# Altium project GateWay.PrjPcb (part 2 of 2)

## Sheet [03].PCIe.SchDoc
size A4; Organization: Altium Limited; Address1: L3, 12a Rodborough Rd; Address2: Frenchs Forest; Address3: NSW; Address4: Australia 2086
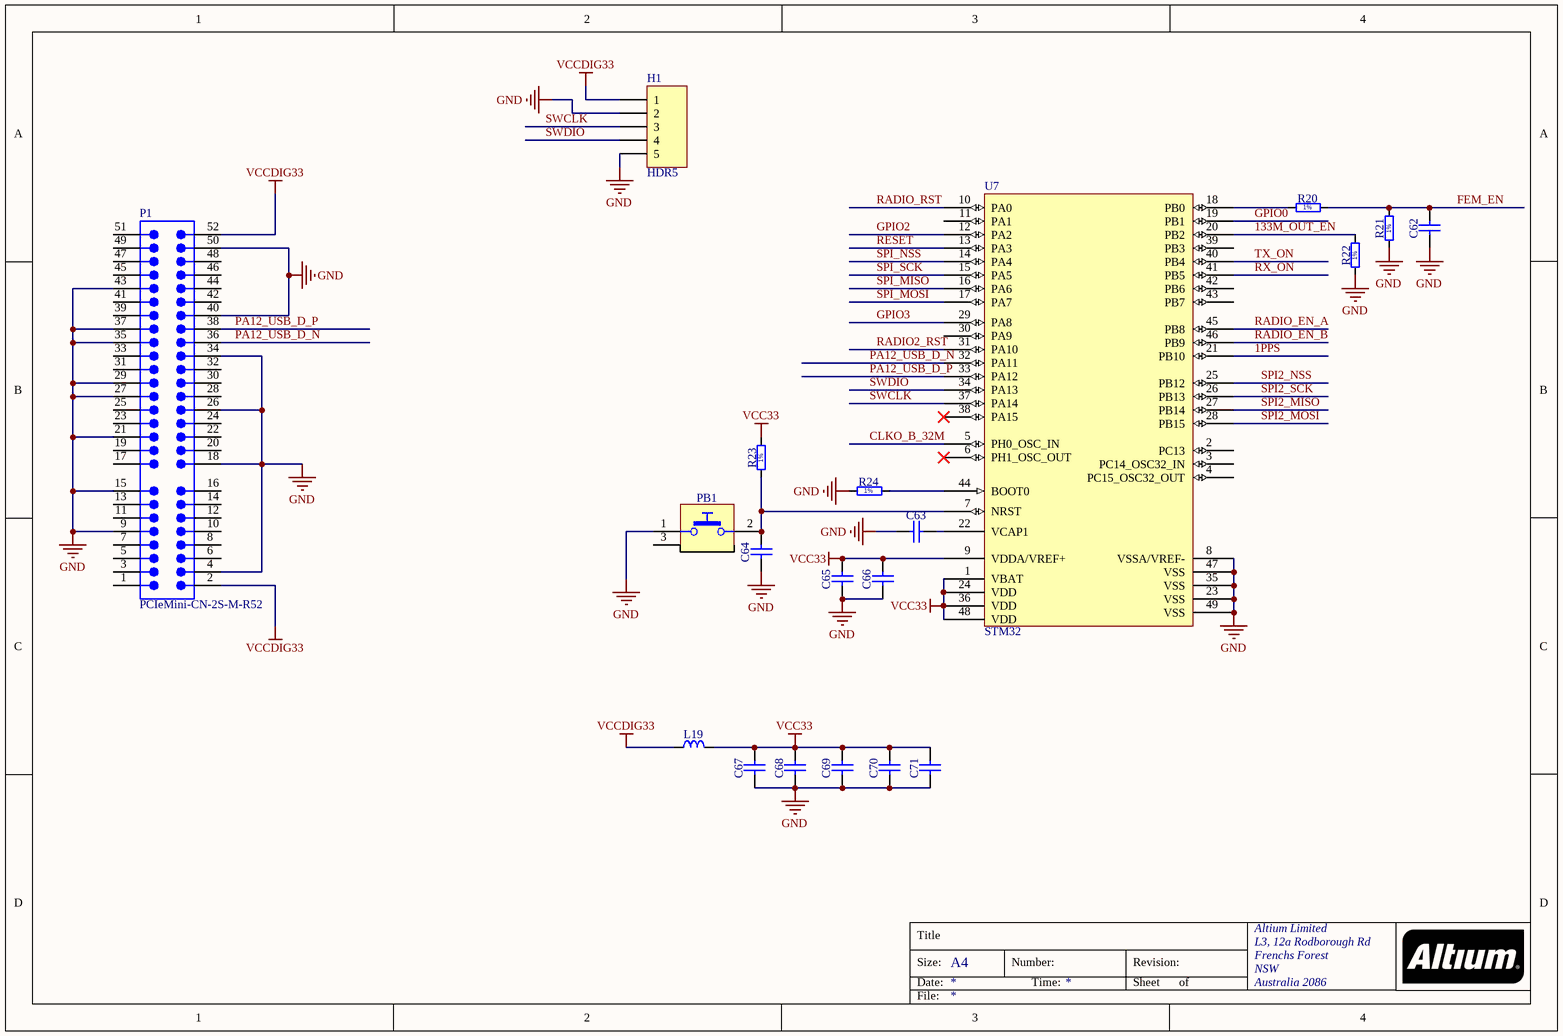
[diagram p4: [03].PCIe.SchDoc]

### Parts
C62  56pF  [CAPC1005X55N]  (value not drawn)
C63  4.7nF  [CAPC1005X55N]  (value not drawn)
C64  100nF  [CAPC1005X55N]  (value not drawn)
C65  100nF  [CAPC1005X55N]  (value not drawn)
C66  100nF  [CAPC1005X55N]  (value not drawn)
C67  4.7nF  [CAPC1005X55N]  (value not drawn)
C68  100nF  [CAPC1005X55N]  (value not drawn)
C69  100nF  [CAPC1005X55N]  (value not drawn)
C70  100nF  [CAPC1005X55N]  (value not drawn)
C71  100nF  [CAPC1005X55N]  (value not drawn)
H1  HDR5  [HDR5]
L19  600R@100MHz  [INDC1005X55N]  (value not drawn)
P1  PCIeMini-CN-2S-M-R52  [PCIeMini-GF-2D-800-1K-S52]  (no BOM)
PB1  Push Button  [PB_OMRON_B3U-1100P]  (value not drawn)
R20  100  [RESC1005X40N]  (value not drawn)
R21  0  [RESC1005X40N]  (value not drawn)
R22  10k  [RESC1005X40N]  (value not drawn)
R23  100k  [RESC1005X40N]  (value not drawn)
R24  100k  [RESC1005X40N]  (value not drawn)
U7  STM32  [STM32]

### Nets
GND: C62.1 C63.1 C64.1 C65.1 C66.1 C67.1 C68.1 C69.1 C70.1 C71.1 H1.2 H1.5 P1.4 P1.9 P1.15 P1.18 P1.21 P1.26 P1.27 P1.29 P1.34 P1.35 P1.37 P1.40 P1.43 P1.50 PB1.1 R21.1 R22.1 R24.1 U7.8(VSSA/VREF-) U7.23(VSS) U7.35(VSS) U7.47(VSS) U7.49(VSS)
VCC33: C65.2 C66.2 C67.2 C68.2 C69.2 C70.2 C71.2 L19.2 R23.2 U7.1(VBAT) U7.9(VDDA/VREF+) U7.24(VDD) U7.36(VDD) U7.48(VDD)
VCCDIG33: H1.1 L19.1 P1.2 P1.52
1PPS: U7.21(PB10)
133M_OUT_EN: R22.2 U7.20(PB2)
CLKO_B_32M: U7.5(PH0_OSC_IN)
FEM_EN: C62.2 R20.2 R21.2
GPIO0: U7.19(PB1)
GPIO2: U7.12(PA2)
GPIO3: U7.29(PA8)
PA12_USB_D_N: P1.36 U7.32(PA11)
PA12_USB_D_P: P1.38 U7.33(PA12)
RADIO2_RST: U7.31(PA10)
RADIO_EN_A: U7.45(PB8)
RADIO_EN_B: U7.46(PB9)
RADIO_RST: U7.10(PA0)
RESET: U7.13(PA3)
RX_ON: U7.41(PB5)
SPI2_MISO: U7.27(PB14)
SPI2_MOSI: U7.28(PB15)
SPI2_NSS: U7.25(PB12)
SPI2_SCK: U7.26(PB13)
SPI_MISO: U7.16(PA6)
SPI_MOSI: U7.17(PA7)
SPI_NSS: U7.14(PA4)
SPI_SCK: U7.15(PA5)
SWCLK: H1.3 U7.37(PA14)
SWDIO: H1.4 U7.34(PA13)
TX_ON: U7.40(PB4)
NetC63_2: C63.2 U7.22(VCAP1)
NetC64_2: C64.2 PB1.2 R23.1 U7.7(NRST)
NetR20_1: R20.1 U7.18(PB0)
NetR24_2: R24.2 U7.44(BOOT0)

Not connected (* = marked no-connect by the designer): P1 1 3 5 6 7 8 10 11 12 13 14 16 17 19 20 22 23 24 25 28 30 31 32 33 39 41 42 44 45 46 47 48 49 51; PB1 3; U7 2(PC13) 3(PC14_OSC32_IN) 4(PC15_OSC32_OUT) 6(PH1_OSC_OUT)* 11(PA1) 30(PA9) 38(PA15)* 39(PB3) 42(PB6) 43(PB7)

### Notes on the sheet
- Title
- Size:
- Date:
- A4
- Number:
- Time:
- Revision:
- Sheet
- of
- File:
- (in symbol R0402_0R_JUMPER) 1%
- (in symbol R0402_10K_1%_0.0625W_100PPM) 1%
- (in symbol R0402_100K_1%_0.0625W_100PPM) 1%
- (in symbol R0402_100R_1%_0.0625W_100PPM) 1%

### Library data of the parts
C62 = CC0603_56PF_50V_5%_NP0: Non-polarised capacitor; Part Description: SMD Multilayer Chip Ceramic Capacitor; Manufacturer: GENERIC; Manufacturer1 Part Number: 223886715569; Voltage: 50V; TC: NP0; Tolerance: ±5%; Table: Capacitors SMD; Part Number: CC0603_56PF_50V_5%_NP0; Component Kind: Standard; Component Type: Standard; Footprint: CAPC1608X87N; Pin Count: 2; Value: 56pF; Status: Preferred; Manufacturer Part Number: CC0603_56PF_50V_5%_NP0; Case: 0603; Mounted: Yes; Socket: No; SMD: Yes; Manufacturer1 Example: PHYCOMP; Manufacturer1 ComponentHeight: 0.87mm; HelpURL: \\cern.ch\dfs\Applications\Altium\Datasheets\CC0603_NP0_PHYCOMP.pdf; Author: CERN DEM JLC; CreateDate: 12/3/2007; LatestRevisionDate: 12/3/2007
C63 C67 = CC0402_4.7NF_16V_10%_X7R: Non-polarised capacitor; Part Description: SMD Multilayer Chip Ceramic Capacitor; Manufacturer: GENERIC; Manufacturer1 Part Number: 223878715632; Voltage: 16V; TC: X7R; Tolerance: ±10%; Table: Capacitors SMD; Part Number: CC0402_4.7NF_16V_10%_X7R; Component Kind: Standard; Component Type: Standard; Pin Count: 2; Value: 4.7nF; Status: Not Recommended; Manufacturer Part Number: CC0402_4.7NF_16V_10%_X7R; Case: 0402; Mounted: Yes; Socket: No; SMD: Yes; Manufacturer1 Example: PHYCOMP; Manufacturer1 ComponentHeight: 0.55mm; HelpURL: \\cern.ch\dfs\Applications\Altium\Datasheets\CC0402_X7R_PHYCOMP.pdf; Author: CERN DEM JLC; CreateDate: 12/3/2007; LatestRevisionDate: 12/3/2007
C64-C66 C68-C71 = CC0402_100NF_16V_10%_X7R: Non-polarised capacitor; Part Description: SMD Multilayer Chip Ceramic Capacitor; Manufacturer: GENERIC; Manufacturer1 Part Number: 223878715649; Voltage: 16V; TC: X7R; Tolerance: ±10%; Table: Capacitors SMD; Part Number: CC0402_100NF_16V_10%_X7R; Component Kind: Standard; Component Type: Standard; Pin Count: 2; Value: 100nF; Status: Not Recommended; Manufacturer Part Number: CC0402_100NF_16V_10%_X7R; Case: 0402; Mounted: Yes; Socket: No; SMD: Yes; Manufacturer1 Example: PHYCOMP; Manufacturer1 ComponentHeight: 0.55mm; HelpURL: \\cern.ch\dfs\Applications\Altium\Datasheets\CC0402_X7R_PHYCOMP.pdf; Author: CERN DEM JLC; CreateDate: 12/3/2007; LatestRevisionDate: 12/3/2007
L19 = IND0402_MURATA_BLM15HD601SN1: Inductor; Part Description: SMD EMIFIL Suppression Chip Ferrite Bead; Manufacturer: MURATA; Manufacturer Part Number: BLM15HD601SN1D; Power: 300mA; Resistance: 0.85R; Tolerance: ±25%; Table: Inductors SMD; Part Number: IND0402_MURATA_BLM15HD601SN1; Component Kind: Standard; Component Type: Standard; Pin Count: 2; Value: 600R@100MHz; Status: None; Case: 0402; Mounted: Yes; Socket: No; SMD: Yes; ComponentHeight: 0.55mm; HelpURL: \\cern.ch\dfs\Applications\Altium\Datasheets\IND0402_MURATA_BLM15H.pdf; Author: CERN DEM JLC; CreateDate: 2/28/2012; LatestRevisionDate: 2/28/2012
P1 = CMP-0001-00067-2: Golden finger, PCIeMini, Dual, Staggered, Pitch 0.8mm, 52-Position; Mating Connector: Tyco-292443-1; Package Version: rev1.2, Oct-2007; System: Connector; Package Reference: PCIeMini-GF-2D-800-1K-S52; Datasheet Version: Revision 1.2 Oct-2007; ClassName: Edge Connector; Publisher: Altium
PB1 = PB_OMRON_B3U-1100P: Push-Button Switch SPDT; Part Description: 3x2.5mm Ultra-Small Tactile SPST Pushbutton Switch (with Ground Terminal),Contact Rating 50mA 12VDC, B3U Serie; Manufacturer: OMRON; Table: Switches; Part Number: PB_OMRON_B3U-1100P; Component Kind: Standard; Component Type: Standard; Pin Count: 3; PackageDescription: Body 1.2x3x2.5mm Ultra-Small Tactile SPST Pushbutton Switch, (with Ground Terminal), OMRON B3U Series; Family: Push Button; Mounted: Yes; Socket: No; SMD: Yes; Status: None; Manufacturer Part Number: PB_OMRON_B3U-1100P; ComponentHeight: 1.75mm; HelpURL: \\cern.ch\dfs\Applications\Altium\Datasheets\PB_OMRON_B3U-1100P.pdf; Author: CERN DEM JLC; CreateDate: 3/16/2010; LatestRevisionDate: 3/16/2010
R20 = R0402_100R_1%_0.0625W_100PPM: Resistor - 1%; Part Description: General Purpose Thick Film Chip Resistor; Manufacturer: GENERIC; Manufacturer1 Part Number: 232270671001L; TC: ±100ppm/°C; Table: Resistors SMD; Part Number: R0402_100R_1%_0.0625W_100PPM; Component Kind: Standard; Component Type: Standard; Pin Count: 2; Value: 100; Status: Not recommended; Power: 0.0625W; Tolerance: ±1%; Manufacturer Part Number: R0402_100R_1%_0.0625W_100PPM; Case: 0402; Mounted: Yes; Socket: No; SMD: Yes; Manufacturer1 Example: YAGEO PHYCOMP; Manufacturer1 ComponentHeight: 0.4mm; HelpURL: \\cern.ch\dfs\Applications\Altium\Datasheets\R0402_Phycomp_RC0402.pdf; Author: CERN DEM JLC; CreateDate: 12/3/2007; LatestRevisionDate: 10/17/2012
R21 = R0402_0R_JUMPER: Resistor - 1%; Part Description: 1A (0.05R Max DC Resistance) Zero Ohm Jumper; Manufacturer: GENERIC; Manufacturer1 Part Number: 232270591001L; Table: Resistors SMD; Part Number: R0402_0R_JUMPER; Component Kind: Standard; Component Type: Standard; Pin Count: 2; Value: 0; Status: Not recommended; Manufacturer Part Number: R0402_0R_JUMPER; Case: 0402; Mounted: Yes; Socket: No; SMD: Yes; Manufacturer1 Example: YAGEO PHYCOMP; Manufacturer1 ComponentHeight: 0.4mm; HelpURL: \\cern.ch\dfs\Applications\Altium\Datasheets\R0402_Phycomp_RC0402.pdf; Author: CERN DEM JLC; CreateDate: 12/3/2007; LatestRevisionDate: 10/17/2012
R22 = R0402_10K_1%_0.0625W_100PPM: Resistor - 1%; Part Description: General Purpose Thick Film Chip Resistor; Manufacturer: GENERIC; Manufacturer1 Part Number: 232270671003L; TC: ±100ppm/°C; Table: Resistors SMD; Part Number: R0402_10K_1%_0.0625W_100PPM; Component Kind: Standard; Component Type: Standard; Pin Count: 2; Value: 10k; Status: Not recommended; Power: 0.0625W; Tolerance: ±1%; Manufacturer Part Number: R0402_10K_1%_0.0625W_100PPM; Case: 0402; Mounted: Yes; Socket: No; SMD: Yes; Manufacturer1 Example: YAGEO PHYCOMP; Manufacturer1 ComponentHeight: 0.4mm; HelpURL: \\cern.ch\dfs\Applications\Altium\Datasheets\R0402_Phycomp_RC0402.pdf; Author: CERN DEM JLC; CreateDate: 12/3/2007; LatestRevisionDate: 10/17/2012
R23 R24 = R0402_100K_1%_0.0625W_100PPM: Resistor - 1%; Part Description: General Purpose Thick Film Chip Resistor; Manufacturer: GENERIC; Manufacturer1 Part Number: 232270671004L; TC: ±100ppm/°C; Table: Resistors SMD; Part Number: R0402_100K_1%_0.0625W_100PPM; Component Kind: Standard; Component Type: Standard; Pin Count: 2; Value: 100k; Status: Not recommended; Power: 0.0625W; Tolerance: ±1%; Manufacturer Part Number: R0402_100K_1%_0.0625W_100PPM; Case: 0402; Mounted: Yes; Socket: No; SMD: Yes; Manufacturer1 Example: YAGEO PHYCOMP; Manufacturer1 ComponentHeight: 0.4mm; HelpURL: \\cern.ch\dfs\Applications\Altium\Datasheets\R0402_Phycomp_RC0402.pdf; Author: CERN DEM JLC; CreateDate: 12/3/2007; LatestRevisionDate: 10/17/2012

## Nets that join several sheets
GND: [01].PSU (16 pins), [02].LORA (110 pins), [03].PCIe (35 pins)
VCC_FEM_1: [01].PSU (C9.2 C10.2 R2.2 U2.1), [02].LORA (L7.1)
VCCA_A: [01].PSU (C5.2 L3.2), [02].LORA (8 pins)
VCCA_B: [01].PSU (C6.2 L4.2), [02].LORA (6 pins)
VCCDIG18_1: [01].PSU (C2.2 C3.2 L1.2 U1.4), [02].LORA (C22.2 L10.1)
VCCDIG33: [01].PSU (7 pins), [02].LORA (8 pins), [03].PCIe (H1.1 L19.1 P1.2 P1.52)
1PPS: [02].LORA (U3.9), [03].PCIe (U7.21)
133M_OUT_EN: [02].LORA (Y1.1), [03].PCIe (R22.2 U7.20)
CLKO_B_32M: [02].LORA (R16.1), [03].PCIe (U7.5)
FEM_EN: [01].PSU (U2.4), [02].LORA (U5.1), [03].PCIe (C62.2 R20.2 R21.2)
GPIO0: [02].LORA (U3.58), [03].PCIe (U7.19)
GPIO2: [02].LORA (U3.56), [03].PCIe (U7.12)
GPIO3: [02].LORA (U3.55), [03].PCIe (U7.29)
RADIO_RST: [02].LORA (D1.2 D3.2), [03].PCIe (U7.10)
RESET: [02].LORA (R11.1 U3.1), [03].PCIe (U7.13)
RX_ON: [02].LORA (R17.1 U3.57), [03].PCIe (U7.41)
SPI_MISO: [02].LORA (U3.3), [03].PCIe (U7.16)
SPI_MOSI: [02].LORA (U3.4), [03].PCIe (U7.17)
SPI_NSS: [02].LORA (U3.5), [03].PCIe (U7.14)
SPI_SCK: [02].LORA (U3.2), [03].PCIe (U7.15)
TX_ON: [02].LORA (R15.1 U3.54), [03].PCIe (U7.40)